# Altium project WiirdFlex.PrjPcb
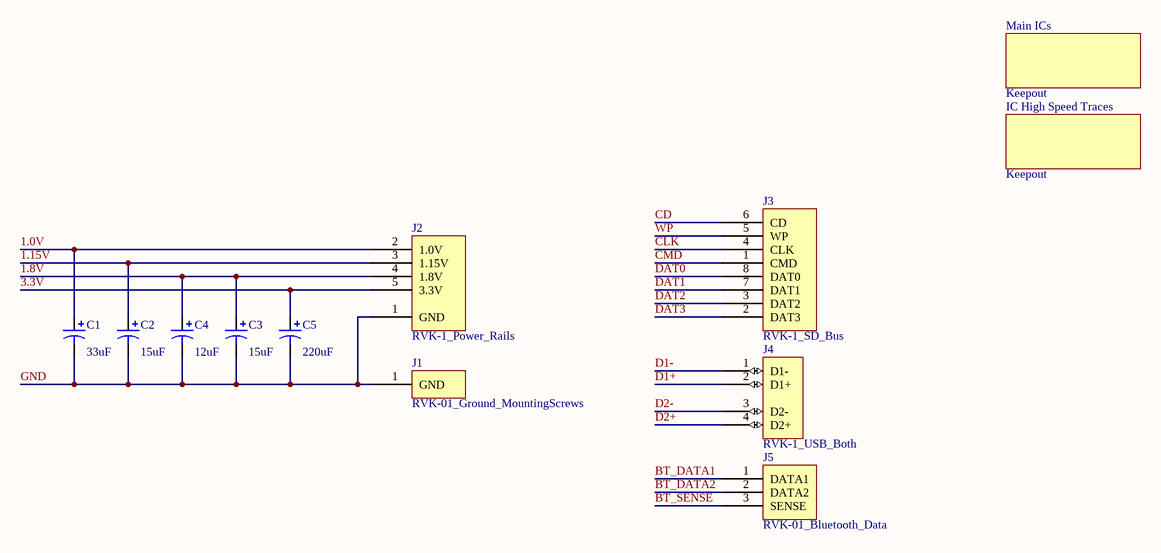
[diagram p0: WiirdFlex Top.SchDoc]
1 sheet, 12 parts. Net scope: global (net labels, ports and power ports of the same name join across sheets).
Board files: WiirdFlex Top.PcbDoc, WiirdFlex Top Alignment.PcbDoc

## Sheet WiirdFlex Top.SchDoc
size A

### Parts
C1  value 33uF  [CAPCP5932X25M]  (hidden comment: Cap Pol3)
C2  value 15uF  [CAPCP5932X25M]  (hidden comment: Cap Pol3)
C3  value 15uF  [CAPCP5932X25M]  (hidden comment: Cap Pol3)
C4  value 12uF  [CAPCP5932X25M]  (hidden comment: Cap Pol3)
C5  value 220uF  [CAPCP5932X25M]  (hidden comment: Cap Pol3)
IC_High_Speed_Traces  Keepout  [RVK-1_Top_Impedance_Control_Area]
J1  RVK-01_Ground_MountingScrews  [RVK-1_GND_Screws]
J2  RVK-1_Power_Rails  [RVK-1_Power_Rails_Top_Direct]
J3  RVK-1_SD_Bus  [RVK-1_SD_Direct]
J4  RVK-1_USB_Both  [RVK-1_USB_Top]
J5  RVK-01_Bluetooth_Data  [RVK-1_BT_Data]
Main_ICs  Keepout  [RVK-1_Main_IC_Keepout]

### Nets
1.0V: C1.1 J2.2(1.0V)
1.8V: C3.1 C4.1 J2.4(1.8V)
1.15V: C2.1 J2.3(1.15V)
3.3V: C5.1 J2.5(3.3V)
BT_DATA1: J5.1(DATA1)
BT_DATA2: J5.2(DATA2)
BT_SENSE: J5.3(SENSE)
CD: J3.6(CD)
CLK: J3.4(CLK)
CMD: J3.1(CMD)
D1+: J4.2(D1+)
D1-: J4.1(D1-)
D2+: J4.4(D2+)
D2-: J4.3(D2-)
DAT0: J3.8(DAT0)
DAT1: J3.7(DAT1)
DAT2: J3.3(DAT2)
DAT3: J3.2(DAT3)
GND: C1.2 C2.2 C3.2 C4.2 C5.2 J1.1(GND) J2.1(GND)
WP: J3.5(WP)

### Library data of the parts
C1-C5 = Cap Pol3: Polarized Capacitor (Surface Mount); Published: 8-Jun-2000; LatestRevisionDate: 29-May-2009; LatestRevisionNote: IPC-7351 Footprint Added.; PackageReference: C0805; Publisher: Altium Limited; PackageDescription: Chip Capacitor
J2 = RVK-1_Power_Rails: Connection points for Wii power rails
IC_High_Speed_Traces Main_ICs = Keepout: ClassName: Keepout